# Altium project digital.PrjPcb
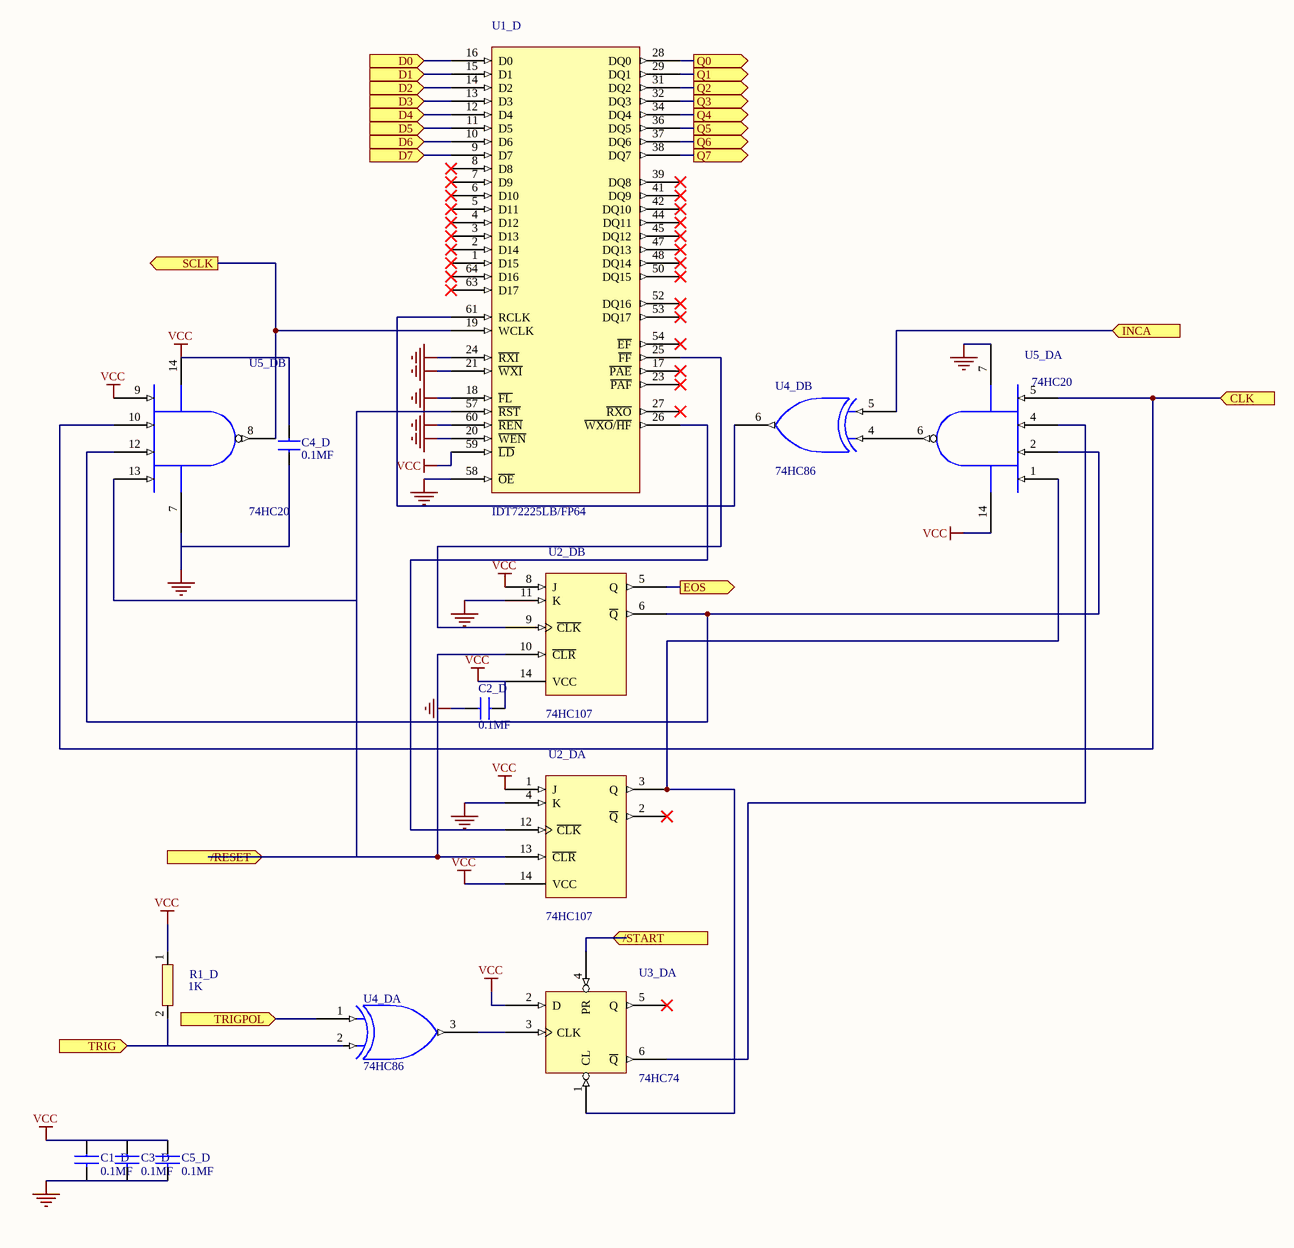
[diagram p0: digital.SchDoc]
1 sheet, 11 parts. Net scope: flat (ports and power ports of the same name join across sheets).

## Sheet digital.SchDoc: RevCode
size OrCAD B; DocumentNumber: Page Create Date; Revision: TitleBlock0; SheetNumber: 1; SheetTotal: 1

### Parts
C1_D  0.1MF  [RAD0.2]
C2_D  0.1MF  [RAD0.2]
C3_D  0.1MF  [RAD0.2]
C4_D  0.1MF  [RAD0.2]
C5_D  0.1MF  [RAD0.2]
R1_D  1K  [AXIAL-0.3]
U1_D  IDT72225LB/FP64  [QFP14X14-64(N)]
U2_D  74HC107  [DIP-14]  (parts A,B of 2)
U3_D  74HC74  [DIP-14]  (part A of 2)
U4_D  74HC86  [DIP-14]  (parts A,B of 4)
U5_D  74HC20  [DIP-14]  (parts A,B of 2)

### Ports
/RESET (in), /START (in), CLK (in), D0 (in), D1 (in), D2 (in), D3 (in), D4 (in), D5 (in), D6 (in), D7 (in), EOS (out), INCA (in), Q0 (out), Q1 (out), Q2 (out), Q3 (out), Q4 (out), Q5 (out), Q6 (out), Q7 (out), SCLK (out), TRIG (in), TRIGPOL (in)

### Nets
GND: C1_D.2 C2_D.1 C3_D.2 C4_D.2 C5_D.2 U1_D.18(~{FL}) U1_D.20(~{WEN}) U1_D.21(~{WXI}) U1_D.24(~{RXI}) U1_D.30(GND) U1_D.35(GND) U1_D.40(GND) U1_D.46(GND) U1_D.51(GND) U1_D.55(GND) U1_D.58(~{OE}) U1_D.60(~{REN}) U1_D.62(GND) U2_D.4(K) U2_D.7(GND) U2_D.11(K) U3_D.7(GND) U4_D.7(GND) U5_D.7(GND)
VCC: C1_D.1 C2_D.2 C3_D.1 C4_D.1 C5_D.1 R1_D.1 U1_D.22(VCC) U1_D.33(VCC) U1_D.43(VCC) U1_D.49(VCC) U1_D.56(VCC) U1_D.59(~{LD}) U2_D.1(J) U2_D.8(J) U2_D.14(VCC) U3_D.2(D) U3_D.14(VCC) U4_D.14(VCC) U5_D.9(A) U5_D.14(VCC)
NetR1_D_2: R1_D.2 U4_D.2(I1) ; port TRIG
NetU1_D_9: U1_D.9(D7) ; port D7
NetU1_D_10: U1_D.10(D6) ; port D6
NetU1_D_11: U1_D.11(D5) ; port D5
NetU1_D_12: U1_D.12(D4) ; port D4
NetU1_D_13: U1_D.13(D3) ; port D3
NetU1_D_14: U1_D.14(D2) ; port D2
NetU1_D_15: U1_D.15(D1) ; port D1
NetU1_D_16: U1_D.16(D0) ; port D0
NetU1_D_19: U1_D.19(WCLK) U5_D.8(Y) ; port SCLK
NetU1_D_25: U1_D.25(~{FF}) U2_D.9(~{CLK})
NetU1_D_26: U1_D.26(~{WXO}/~{HF}) U2_D.12(~{CLK})
NetU1_D_28: U1_D.28(DQ0) ; port Q0
NetU1_D_29: U1_D.29(DQ1) ; port Q1
NetU1_D_31: U1_D.31(DQ2) ; port Q2
NetU1_D_32: U1_D.32(DQ3) ; port Q3
NetU1_D_34: U1_D.34(DQ4) ; port Q4
NetU1_D_36: U1_D.36(DQ5) ; port Q5
NetU1_D_37: U1_D.37(DQ6) ; port Q6
NetU1_D_38: U1_D.38(DQ7) ; port Q7
NetU1_D_57: U1_D.57(~{RST}) U2_D.10(~{CLR}) U2_D.13(~{CLR}) U5_D.13(D) ; port /RESET
NetU1_D_61: U1_D.61(RCLK) U4_D.6(O)
NetU2_D_3: U2_D.3(Q) U3_D.1(CL) U5_D.1(A)
NetU2_D_5: U2_D.5(Q) ; port EOS
NetU2_D_6: U2_D.6(~{Q}) U5_D.2(B) U5_D.12(C)
NetU3_D_3: U3_D.3(CLK) U4_D.3(O)
NetU3_D_4: U3_D.4(PR) ; port /START
NetU3_D_6: U3_D.6(~{Q}) U5_D.4(C)
NetU4_D_1: U4_D.1(I0) ; port TRIGPOL
NetU4_D_4: U4_D.4(I0) U5_D.6(Y)
NetU4_D_5: U4_D.5(I1) ; port INCA
NetU5_D_5: U5_D.5(D) U5_D.10(B) ; port CLK

Not connected (* = marked no-connect by the designer): U1_D 1(D15)* 2(D14)* 3(D13)* 4(D12)* 5(D11)* 6(D10)* 7(D9)* 8(D8)* 17(~{PAE})* 23(~{PAF})* 27(~{RXO})* 39(DQ8)* 41(DQ9)* 42(DQ10)* 44(DQ11)* 45(DQ12)* 47(DQ13)* 48(DQ14)* 50(DQ15)* 52(DQ16)* 53(DQ17)* 54(~{EF})* 63(D17)* 64(D16)*; U2_D 2(~{Q})*; U3_D 5(Q)*

### Library data of the parts
C1_D C3_D C5_D = CAP NP: Text Field1: 20; Text Field2: 10
C2_D C4_D = CAP: Capacitor; Value: 0.1MF
R1_D = R2: Text Field1: 20; Text Field2: 30
U1_D = IDT72225LB/FP64: Text Field1: 110; Text Field2: 330
U2_D = 74HC107: Text Field1: 60; Text Field2: 90
U3_D = 74HC74: Text Field1: 60; Text Field2: 60
U4_D = 74HC86: Text Field1: 60; Text Field2: 40
U5_D = 74HC20: Text Field1: 60; Text Field2: 80